# Altium schematic sheet Network.SchDoc
size A4
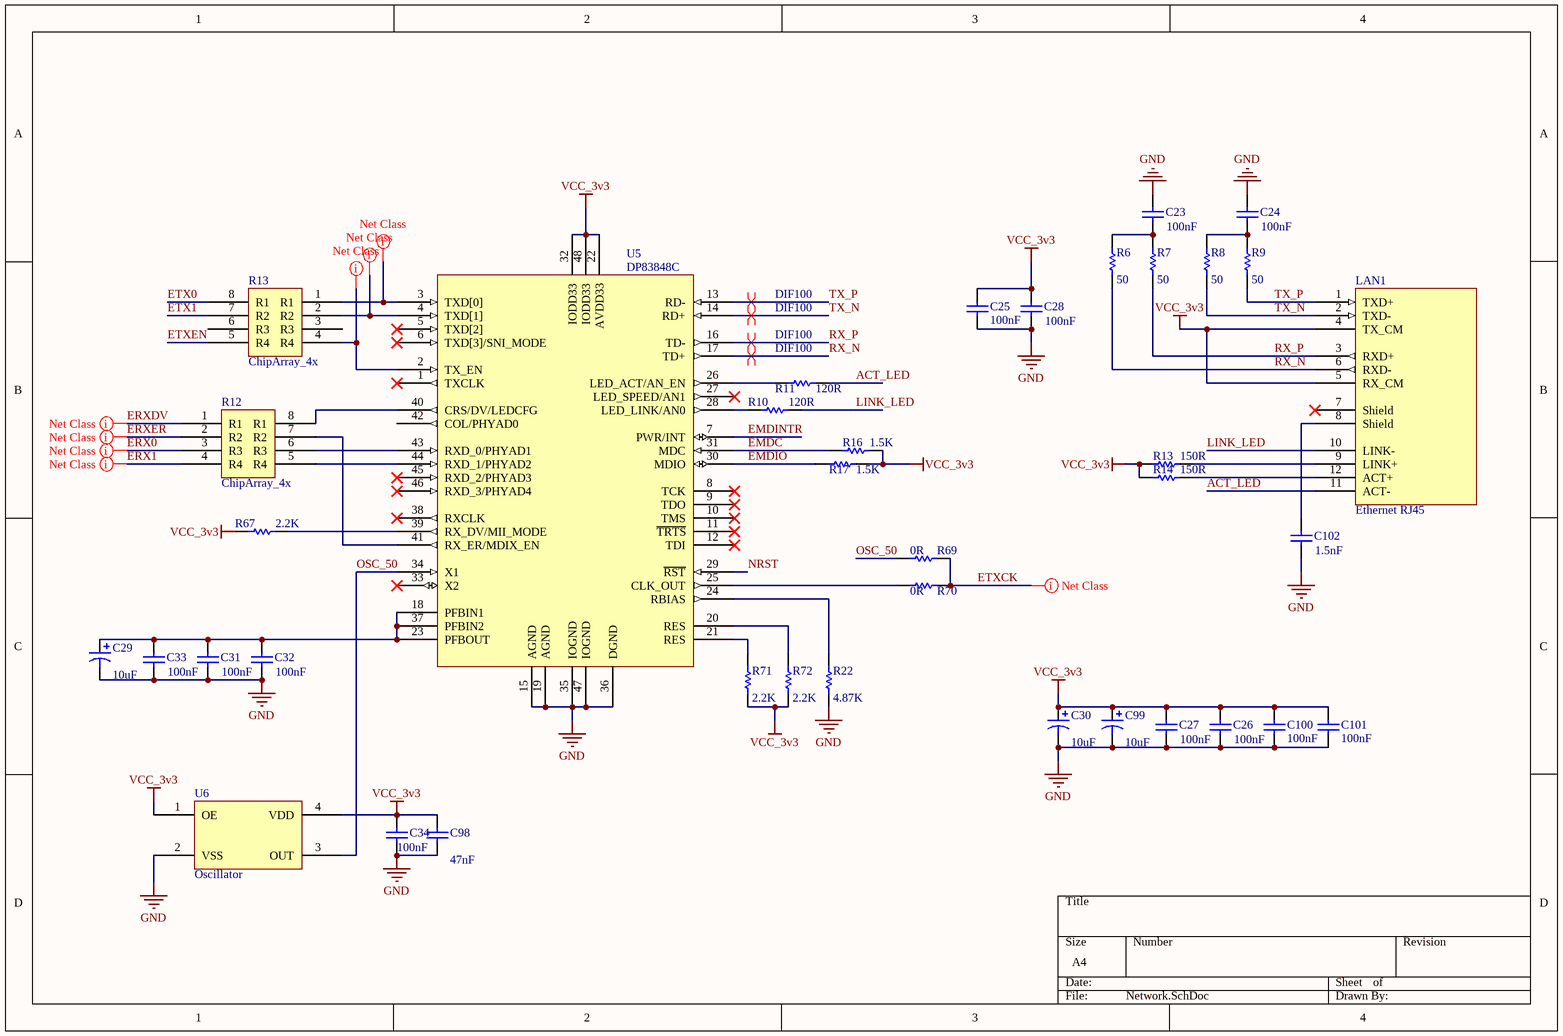
[diagram p0: Network.SchDoc]

## Parts
(Parts that share a designator on the sheet are numbered #1, #2 ... from top to bottom, then left to right.)
C23  value 100nF  [0603PKG]  (hidden comment: Cap)
C24  value 100nF  [0603PKG]  (hidden comment: Cap)
C25  value 100nF  [0603PKG]  (hidden comment: Cap)
C26  value 100nF  [0603PKG]  (hidden comment: Cap)
C27  value 100nF  [0603PKG]  (hidden comment: Cap)
C28  value 100nF  [0603PKG]  (hidden comment: Cap)
C29  value 10uF  [3216X18N]  (hidden comment: Cap Pol3)
C30  value 10uF  [3216X18N]  (hidden comment: Cap Pol3)
C31  value 100nF  [0603PKG]  (hidden comment: Cap)
C32  value 100nF  [0603PKG]  (hidden comment: Cap)
C33  value 100nF  [0603PKG]  (hidden comment: Cap)
C34  value 100nF  [0603PKG]  (hidden comment: Cap)
C98  value 47nF  [0603PKG]  (hidden comment: Cap)
C99  value 10uF  [3216X18N]  (hidden comment: Cap Pol3)
C100  value 100nF  [0603PKG]  (hidden comment: Cap)
C101  value 100nF  [0603PKG]  (hidden comment: Cap)
C102  value 1.5nF  [C0805]  (hidden comment: Cap)
LAN1  Ethernet RJ45  [RJ45]
R6  value 50  [C0805]  (hidden comment: Res Semi)
R7  value 50  [C0805]  (hidden comment: Res Semi)
R8  value 50  [C0805]  (hidden comment: Res Semi)
R9  value 50  [C0805]  (hidden comment: Res Semi)
R10  value 120R  [C0805]  (hidden comment: Res Semi)
R11  value 120R  [C0805]  (hidden comment: Res Semi)
R12  ChipArray_4x  [CAC-50P205X105-8M]
R13#1  ChipArray_4x  [CAC-50P205X105-8M]
R13#2  value 150R  [C0805]  (hidden comment: Res Semi)
R14  value 150R  [C0805]  (hidden comment: Res Semi)
R16  value 1.5K  [C0805]  (hidden comment: Res Semi)
R17  value 1.5K  [C0805]  (hidden comment: Res Semi)
R22  value 4.87K  [C0805]  (hidden comment: Res Semi)
R67  value 2.2K  [C0805]  (hidden comment: Res Semi)
R69  value 0R  [C0805]  (hidden comment: Res Semi)
R70  value 0R  [C0805]  (hidden comment: Res Semi)
R71  value 2.2K  [C0805]  (hidden comment: Res Semi)
R72  value 2.2K  [C0805]  (hidden comment: Res Semi)
U5  DP83848C  [LQFP48]
U6  Oscillator  [Crystal5x7]

## Nets
GND: C23.2 C24.2 C25.2 C26.1 C27.1 C28.1 C29.2 C30.2 C31.1 C32.1 C33.1 C34.1 C98.1 C99.2 C100.1 C101.1 C102.1 R22.1 U5.15(AGND) U5.19(AGND) U5.35(IOGND) U5.36(DGND) U5.47(IOGND) U6.2(VSS)
VCC_3v3: C25.1 C26.2 C27.2 C28.2 C30.1 C34.2 C98.2 C99.1 C100.2 C101.2 LAN1.4(TX_CM) LAN1.5(RX_CM) R13#2.1 R14.1 R16.2 R17.1 R67.2 R71.1 R72.1 U5.22(AVDD33) U5.32(IODD33) U5.48(IODD33) U6.1(OE) U6.4(VDD)
ACT_LED: LAN1.11(ACT-) R11.2
EMDC: R16.1 U5.31(MDC)
EMDINTR: U5.7(PWR/INT)
EMDIO: R17.2 U5.30(MDIO)
ERX0: R12.3(R3)
ERX1: R12.4(R4)
ERXDV: R12.1(R1)
ERXER: R12.2(R2)
ETX0: R13#1.8(R1)
ETX1: R13#1.7(R2)
ETXCK: R69.1 R70.1
ETXEN: R13#1.5(R4)
LINK_LED: LAN1.10(LINK-) R10.2
NRST: U5.29(~{RST})
OSC_50: R69.2 U5.34(X1) U6.3(OUT)
RX_N: LAN1.6(RXD-) R6.1 U5.17(TD+)
RX_P: LAN1.3(RXD+) R7.1 U5.16(TD-)
TX_N: LAN1.2(TXD-) R8.1 U5.14(RD+)
TX_P: LAN1.1(TXD+) R9.1 U5.13(RD-)
NetC23_1: C23.1 R6.2 R7.2
NetC24_1: C24.1 R8.2 R9.2
NetC29_1: C29.1 C31.2 C32.2 C33.2 U5.18(PFBIN1) U5.23(PFBOUT) U5.37(PFBIN2)
NetC102_2: C102.2 LAN1.8(Shield)
NetLAN1_9: LAN1.9(LINK+) R13#2.2
NetLAN1_12: LAN1.12(ACT+) R14.2
NetR10_1: R10.1 U5.28(LED_LINK/AN0)
NetR11_1: R11.1 U5.26(LED_ACT/AN_EN)
NetR12_5: R12.5(R4) U5.44(RXD_1/PHYAD2)
NetR12_6: R12.6(R3) U5.43(RXD_0/PHYAD1)
NetR12_7: R12.7(R2) U5.41(RX_ER/MDIX_EN)
NetR12_8: R12.8(R1) U5.40(CRS/DV/LEDCFG)
NetR13#1_1: R13#1.1(R1) U5.3(TXD[0])
NetR13#1_2: R13#1.2(R2) U5.4(TXD[1])
NetR13#1_4: R13#1.4(R4) U5.2(TX_EN)
NetR22_2: R22.2 U5.24(RBIAS)
NetR67_1: R67.1 U5.39(RX_DV/MII_MODE)
NetR70_2: R70.2 U5.25(CLK_OUT)
NetR71_2: R71.2 U5.21(RES)
NetR72_2: R72.2 U5.20(RES)

Not connected (* = marked no-connect by the designer): LAN1 7(Shield)*; R13#1 3(R3) 6(R3); U5 1(TXCLK)* 5(TXD[2])* 6(TXD[3]/SNI_MODE)* 8(TCK)* 9(TDO)* 10(TMS)* 11(~{TRTS})* 12(TDI)* 27(LED_SPEED/AN1)* 33(X2)* 38(RXCLK)* 42(COL/PHYAD0) 45(RXD_2/PHYAD3)* 46(RXD_3/PHYAD4)*

## Layout directives
differential pair; net class DIF100: RX_N, RX_P, TX_N, TX_P
net class Rx: NetR13#1_1, NetR13#1_2, NetR13#1_4
net class Tx: ERX0, ERX1, ERXDV, ERXER
net class CLK: ETXCK

## Library data of the parts
C23-C28 C31-C34 C98 C100-C102 = Cap: Capacitor; Published: 8-Jun-2000; LatestRevisionDate: 17-Jul-2002; LatestRevisionNote: Re-released for DXP Platform.; PackageReference: RAD-0.3; Publisher: Altium Limited; PackageDescription: Radial Cap, Thru-Hole; 2 Leads; 0.3 in Pin Spacing
C29 C30 C99 = Cap Pol3: Polarized Capacitor (Surface Mount); Published: 8-Jun-2000; LatestRevisionDate: 29-May-2009; LatestRevisionNote: IPC-7351 Footprint Added.; PackageReference: C0805; Publisher: Altium Limited; PackageDescription: Chip Capacitor
LAN1 = Ethernet_RJ45
R6-R11 R13#2 R14 R16 R17 R22 R67 R69-R72 = Res Semi: Semiconductor Resistor; Published: 8-Jun-2000; LatestRevisionDate: 17-Jul-2002; LatestRevisionNote: Re-released for DXP Platform.; PackageReference: AXIAL-0.5; Publisher: Altium Limited; PackageDescription: Axial Device, Thru-Hole; 2 Leads; 0.5 in Pin Spacing